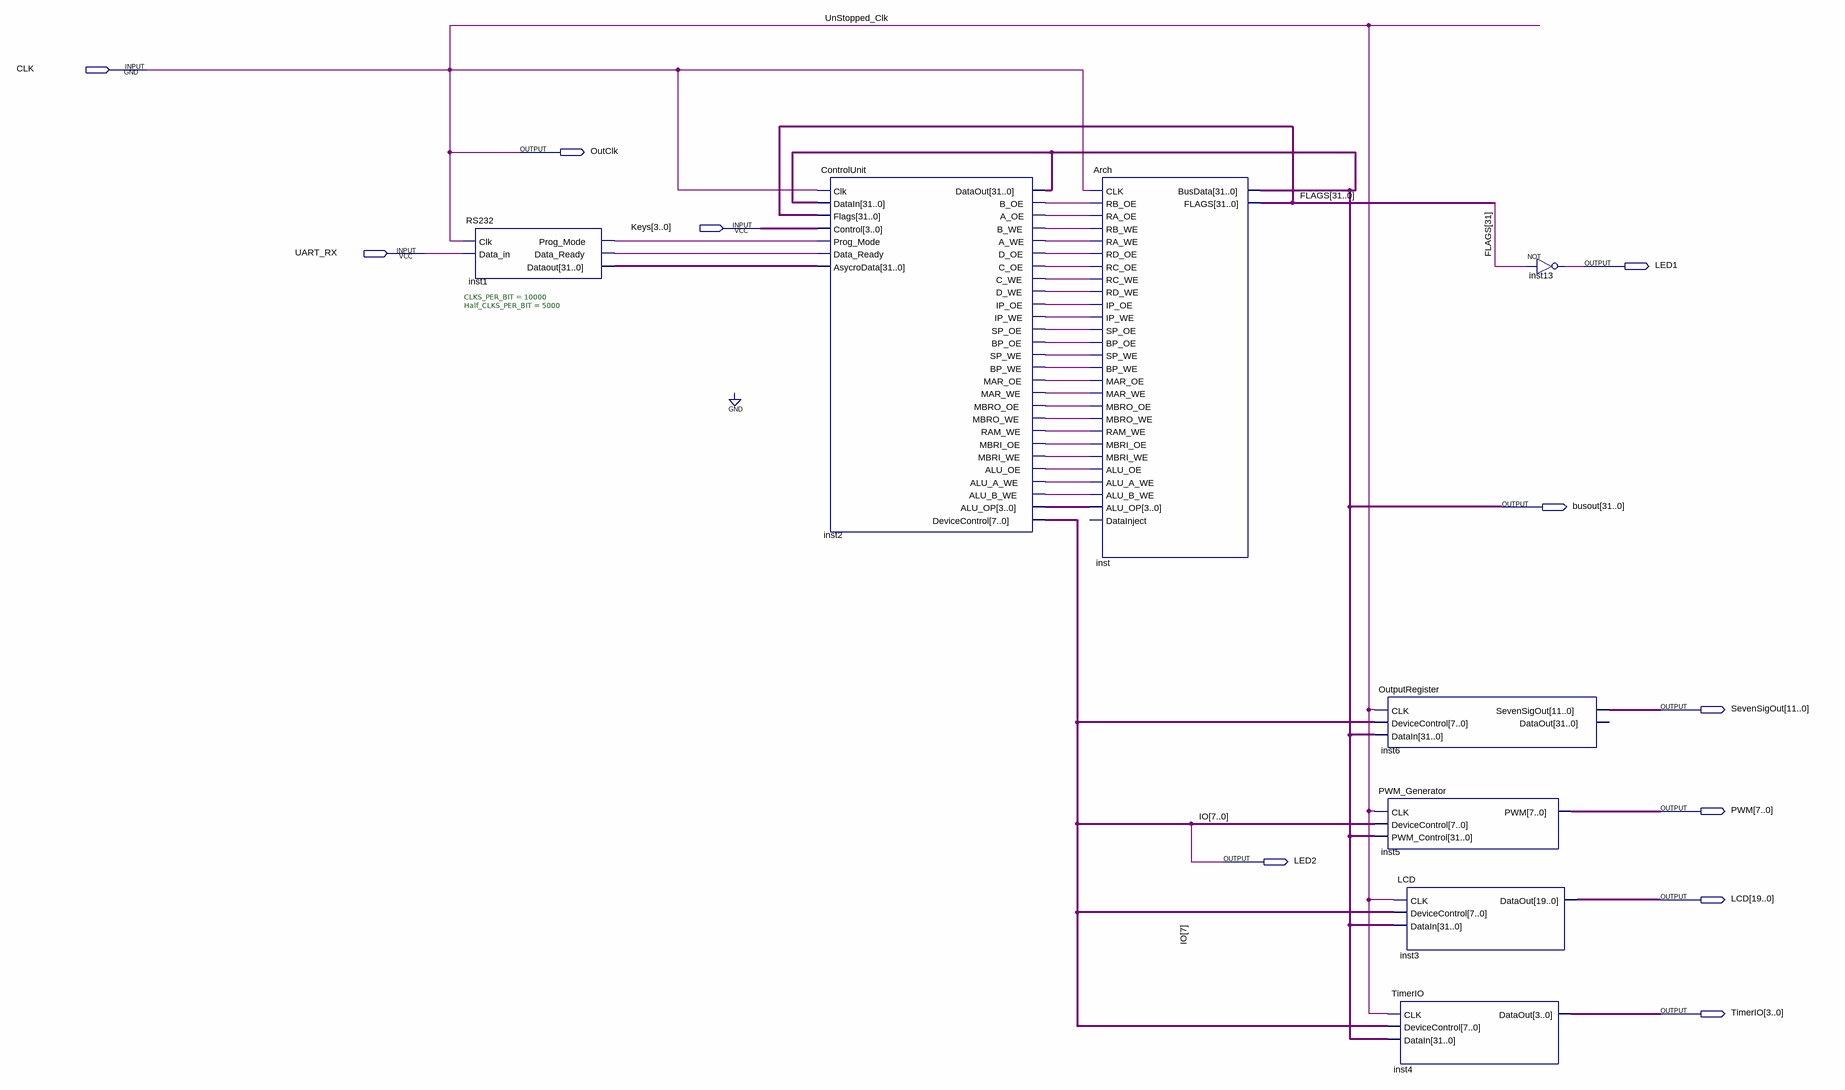
[diagram p0: schematic sheet]
// Quartus schematic OverallArchitcture.bdf as structural Verilog: 8 symbols, 11 pins
module OverallArchitcture (
  input  CLK,
  input  [3:0] Keys,
  input  UART_RX,
  output OutClk,
  output LED1,
  output [31:0] busout,
  output [11:0] SevenSigOut,
  output [7:0] PWM,
  output LED2,
  output [19:0] LCD,
  output [3:0] TimerIO
);

  wire inst1_data_ready, inst1_prog_mode, inst2_a_oe, inst2_a_we, inst2_alu_a_we, inst2_alu_b_we,
       inst2_alu_oe, inst2_b_oe, inst2_b_we, inst2_bp_oe, inst2_bp_we, inst2_c_oe, inst2_c_we, inst2_d_oe,
       inst2_d_we, inst2_ip_oe, inst2_ip_we, inst2_mar_oe, inst2_mar_we, inst2_mbri_oe, inst2_mbri_we,
       inst2_mbro_oe, inst2_mbro_we, inst2_ram_we, inst2_sp_oe, inst2_sp_we;
  wire [3:0] inst2_alu_op;
  wire [6:0] IO;
  wire [31:0] FLAGS, inst1_dataout;

  RS232 #(.CLKS_PER_BIT(10000), .Half_CLKS_PER_BIT(5000)) inst1 (
    .Clk(CLK), .Data_in(UART_RX), .Data_Ready(inst1_data_ready), .Prog_Mode(inst1_prog_mode),
    .Dataout(inst1_dataout));
  ControlUnit inst2 (
    .Clk(CLK), .DataIn(busout), .Flags(FLAGS), .Control(Keys), .Prog_Mode(inst1_prog_mode),
    .Data_Ready(inst1_data_ready), .AsycroData(inst1_dataout), .DataOut(busout), .B_OE(inst2_b_oe),
    .A_OE(inst2_a_oe), .B_WE(inst2_b_we), .A_WE(inst2_a_we), .D_OE(inst2_d_oe), .C_OE(inst2_c_oe),
    .C_WE(inst2_c_we), .D_WE(inst2_d_we), .IP_OE(inst2_ip_oe), .IP_WE(inst2_ip_we), .SP_OE(inst2_sp_oe),
    .BP_OE(inst2_bp_oe), .SP_WE(inst2_sp_we), .BP_WE(inst2_bp_we), .MAR_OE(inst2_mar_oe),
    .MAR_WE(inst2_mar_we), .MBRO_OE(inst2_mbro_oe), .MBRO_WE(inst2_mbro_we), .RAM_WE(inst2_ram_we),
    .MBRI_OE(inst2_mbri_oe), .MBRI_WE(inst2_mbri_we), .ALU_OE(inst2_alu_oe), .ALU_A_WE(inst2_alu_a_we),
    .ALU_B_WE(inst2_alu_b_we), .ALU_OP(inst2_alu_op), .DeviceControl({LED2, IO}));
  Arch inst (
    .CLK(CLK), .RB_OE(inst2_b_oe), .RA_OE(inst2_a_oe), .RB_WE(inst2_b_we), .RA_WE(inst2_a_we),
    .RD_OE(inst2_d_oe), .RC_OE(inst2_c_oe), .RC_WE(inst2_c_we), .RD_WE(inst2_d_we), .IP_OE(inst2_ip_oe),
    .IP_WE(inst2_ip_we), .SP_OE(inst2_sp_oe), .BP_OE(inst2_bp_oe), .SP_WE(inst2_sp_we), .BP_WE(inst2_bp_we),
    .MAR_OE(inst2_mar_oe), .MAR_WE(inst2_mar_we), .MBRO_OE(inst2_mbro_oe), .MBRO_WE(inst2_mbro_we),
    .RAM_WE(inst2_ram_we), .MBRI_OE(inst2_mbri_oe), .MBRI_WE(inst2_mbri_we), .ALU_OE(inst2_alu_oe),
    .ALU_A_WE(inst2_alu_a_we), .ALU_B_WE(inst2_alu_b_we), .ALU_OP(inst2_alu_op), .BusData(busout),
    .FLAGS(FLAGS));  // open: DataInject
  OutputRegister inst6 (
    .CLK(CLK), .DeviceControl({LED2, IO}), .DataIn(busout), .SevenSigOut(SevenSigOut));  // open: DataOut
  PWM_Generator inst5 (.CLK(CLK), .DeviceControl({LED2, IO}), .PWM_Control(busout), .PWM(PWM));
  LCD inst3 (.CLK(CLK), .DeviceControl({LED2, IO}), .DataIn(busout), .DataOut(LCD));
  TimerIO inst4 (.CLK(CLK), .DeviceControl({LED2, IO}), .DataIn(busout), .DataOut(TimerIO));
  not inst13 (LED1, FLAGS[31]);

  assign OutClk = CLK;

  // Other names for the same wires on the sheet: IO[7] = LED2; UnStopped_Clk = CLK
endmodule
